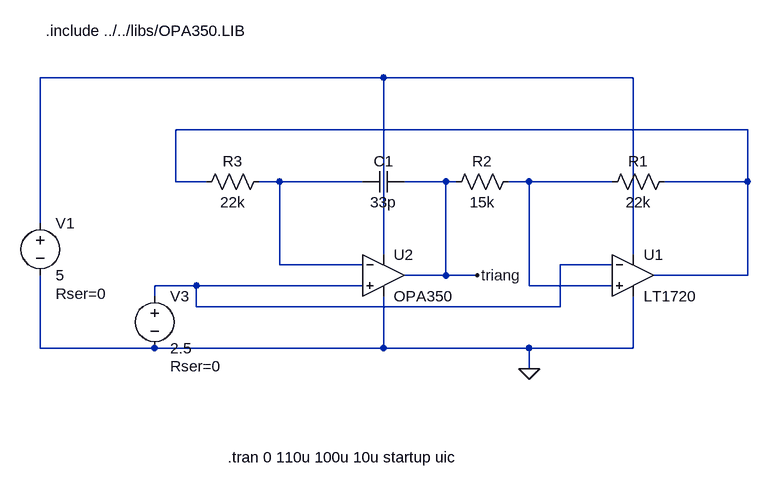
[diagram p0: schematic oscillator.asc]
oscillator.asc, the LTspice schematic file:
Version 4
SHEET 1 1412 680
WIRE -32 -112 -560 -112
WIRE 352 -112 -32 -112
WIRE 528 -32 -352 -32
WIRE -352 48 -352 -32
WIRE -304 48 -352 48
WIRE -192 48 -224 48
WIRE -64 48 -192 48
WIRE 64 48 0 48
WIRE 80 48 64 48
WIRE 192 48 160 48
WIRE 320 48 192 48
WIRE 528 48 528 -32
WIRE 528 48 400 48
WIRE -560 112 -560 -112
WIRE -32 160 -32 -112
WIRE 352 160 352 -112
WIRE -192 176 -192 48
WIRE -64 176 -192 176
WIRE 320 176 240 176
WIRE 64 192 64 48
WIRE 64 192 0 192
WIRE 112 192 64 192
WIRE 528 192 528 48
WIRE 528 192 384 192
WIRE -320 208 -384 208
WIRE -64 208 -320 208
WIRE 192 208 192 48
WIRE 320 208 192 208
WIRE -384 224 -384 208
WIRE -320 240 -320 208
WIRE 240 240 240 176
WIRE 240 240 -320 240
WIRE -560 304 -560 192
WIRE -384 304 -560 304
WIRE -32 304 -32 224
WIRE -32 304 -384 304
WIRE 192 304 -32 304
WIRE 352 304 352 224
WIRE 352 304 192 304
WIRE 192 336 192 304
FLAG 192 336 0
FLAG 112 192 triang
SYMBOL res 416 32 R90
WINDOW 0 0 56 VBottom 2
WINDOW 3 32 56 VTop 2
SYMATTR InstName R1
SYMATTR Value 22k
SYMBOL res 176 32 R90
WINDOW 0 0 56 VBottom 2
WINDOW 3 32 56 VTop 2
SYMATTR InstName R2
SYMATTR Value 15k
SYMBOL res -208 32 R90
WINDOW 0 0 56 VBottom 2
WINDOW 3 32 56 VTop 2
SYMATTR InstName R3
SYMATTR Value 22k
SYMBOL cap 0 32 R90
WINDOW 0 0 32 VBottom 2
WINDOW 3 32 32 VTop 2
SYMATTR InstName C1
SYMATTR Value 33p
SYMBOL voltage -560 96 R0
WINDOW 123 0 0 Left 2
WINDOW 39 24 124 Left 2
SYMATTR SpiceLine Rser=0
SYMATTR InstName V1
SYMATTR Value 5
SYMBOL voltage -384 208 R0
WINDOW 123 0 0 Left 2
WINDOW 39 24 124 Left 2
SYMATTR SpiceLine Rser=0
SYMATTR InstName V3
SYMATTR Value 2.5
SYMBOL Comparators\\LT1720 352 128 R0
SYMATTR InstName U1
SYMBOL Opamps\\opamp2 -32 128 R0
SYMATTR InstName U2
SYMATTR Value OPA350
TEXT -272 472 Left 2 !.tran 0 110u 100u 10u startup uic
TEXT -552 -184 Left 2 !.include ../../libs/OPA350.LIB

The netlist it stands for:
* oscillator.asc
R1 N002 N004 22k
R2 N004 triang 15k
R3 N003 N002 22k
C1 triang N003 33p
V1 N001 0 5 Rser=0
V3 N005 0 2.5 Rser=0
XU1 N004 N005 N001 0 N002 LT1720  ; pins In+ In- V+ V- OUT
XU2 N005 N003 N001 0 triang OPA350  ; pins In+ In- V+ V- OUT
.tran 0 110u 100u 10u startup uic
.include ../../libs/OPA350.LIB
.lib LT1720.sub
.backanno
.end